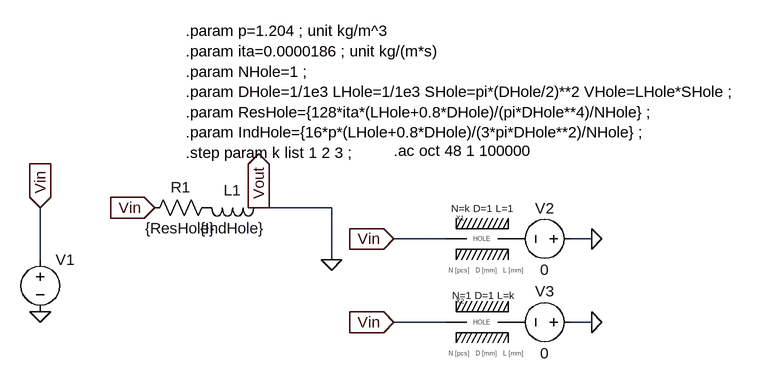
[diagram p0: schematic Hole_test.asc]
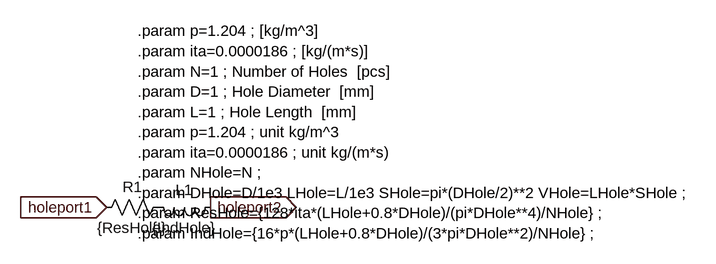
[diagram p1: sub-circuit holemodel.asc]
Hole_test.asc, the LTspice schematic file:
Version 4
SHEET 1 1264 680
WIRE 432 432 320 432
WIRE 608 480 528 480
WIRE 832 480 800 480
WIRE -16 512 -16 432
WIRE 432 512 432 432
WIRE 608 608 528 608
WIRE 832 608 800 608
FLAG 160 432 Vin
IOPIN 160 432 In
FLAG 320 432 Vout
IOPIN 320 432 Out
FLAG -16 592 0
FLAG 432 512 0
FLAG -16 432 Vin
IOPIN -16 432 In
FLAG 832 480 0
FLAG 832 608 0
FLAG 528 608 Vin
IOPIN 528 608 In
FLAG 528 480 Vin
IOPIN 528 480 In
SYMBOL res 256 416 R90
WINDOW 0 0 56 VBottom 2
WINDOW 3 32 56 VTop 2
SYMATTR InstName R1
SYMATTR Value {ResHole}
SYMBOL ind 336 416 R90
WINDOW 0 5 56 VBottom 2
WINDOW 3 32 56 VTop 2
SYMATTR InstName L1
SYMATTR Value {IndHole}
SYMBOL voltage -16 496 R0
SYMATTR InstName V1
SYMATTR Value ""
SYMATTR Value2 AC 1
SYMBOL voltage 816 480 R90
WINDOW 0 -32 56 VBottom 2
WINDOW 3 32 56 VTop 2
SYMATTR InstName V2
SYMATTR Value 0
SYMATTR SpiceLine Rser=0
SYMBOL voltage 816 608 R90
WINDOW 0 -32 56 VBottom 2
WINDOW 3 32 56 VTop 2
SYMATTR InstName V3
SYMATTR Value 0
SYMATTR SpiceLine Rser=0
SYMBOL My_symbol/Holemodel 624 448 R0
WINDOW 0 0 0 Left 0
WINDOW 39 -8 -15 Left 1
SYMATTR InstName X1
SYMATTR SpiceLine N=k D=1 L=1
SYMBOL My_symbol/Holemodel 624 576 R0
WINDOW 0 0 0 Left 0
WINDOW 39 -6 -9 Left 1
SYMATTR InstName X2
SYMATTR SpiceLine N=1 D=1 L=k
TEXT 208 160 Left 2 !.param p=1.204 ; unit kg/m^3\n.param ita=0.0000186 ; unit kg/(m*s)\n.param NHole=1 ;\n.param DHole=1/1e3 LHole=1/1e3 SHole=pi*(DHole/2)**2 VHole=LHole*SHole ;\n.param ResHole={128*ita*(LHole+0.8*DHole)/(pi*DHole**4)/NHole} ;\n.param IndHole={16*p*(LHole+0.8*DHole)/(3*pi*DHole**2)/NHole} ;\n.step param k list 1 2 3 ;
TEXT 528 344 Left 2 !.ac oct 48 1 100000

holemodel.asc, the sub-circuit schematic file:
Version 4
SHEET 1 1216 680
FLAG 160 432 holeport1
IOPIN 160 432 In
FLAG 320 432 holeport2
IOPIN 320 432 Out
SYMBOL res 256 416 R90
WINDOW 0 0 56 VBottom 2
WINDOW 3 32 56 VTop 2
SYMATTR InstName R1
SYMATTR Value {ResHole}
SYMBOL ind 336 416 R90
WINDOW 0 5 56 VBottom 2
WINDOW 3 32 56 VTop 2
SYMATTR InstName L1
SYMATTR Value {IndHole}
TEXT 208 160 Left 2 !.param p=1.204 ; [kg/m^3]\n.param ita=0.0000186 ; [kg/(m*s)]\n.param N=1 ; Number of Holes  [pcs]\n.param D=1 ; Hole Diameter  [mm]\n.param L=1 ; Hole Length  [mm]\n.param p=1.204 ; unit kg/m^3\n.param ita=0.0000186 ; unit kg/(m*s)\n.param NHole=N ;\n.param DHole=D/1e3 LHole=L/1e3 SHole=pi*(DHole/2)**2 VHole=LHole*SHole ;\n.param ResHole={128*ita*(LHole+0.8*DHole)/(pi*DHole**4)/NHole} ;\n.param IndHole={16*p*(LHole+0.8*DHole)/(3*pi*DHole**2)/NHole} ;

The netlist it stands for:
* Hole_test.asc
R1 P001 Vin {ResHole}
L1 0 P001 {IndHole}
V1 Vin 0 AC 1
V2 0 P002 0 Rser=0
V3 0 P003 0 Rser=0
XX1 Vin P002 holemodel params: N=k D=1 L=1
XX2 Vin P003 holemodel params: N=1 D=1 L=k

* block symbol definitions
.subckt holemodel holeport1 holeport2
R1 P001 holeport1 {ResHole}
L1 holeport2 P001 {IndHole}
.param p=1.204 ; [kg/m^3]
.param ita=0.0000186 ; [kg/(m*s)]
.param N=1 ; Number of Holes  [pcs]
.param D=1 ; Hole Diameter  [mm]
.param L=1 ; Hole Length  [mm]
.param p=1.204 ; unit kg/m^3
.param ita=0.0000186 ; unit kg/(m*s)
.param NHole=N ;
.param DHole=D/1e3 LHole=L/1e3 SHole=pi*(DHole/2)**2 VHole=LHole*SHole ;
.param ResHole={128*ita*(LHole+0.8*DHole)/(pi*DHole**4)/NHole} ;
.param IndHole={16*p*(LHole+0.8*DHole)/(3*pi*DHole**2)/NHole} ;
.ends holemodel

.param p=1.204 ; unit kg/m^3
.param ita=0.0000186 ; unit kg/(m*s)
.param NHole=1 ;
.param DHole=1/1e3 LHole=1/1e3 SHole=pi*(DHole/2)**2 VHole=LHole*SHole ;
.param ResHole={128*ita*(LHole+0.8*DHole)/(pi*DHole**4)/NHole} ;
.param IndHole={16*p*(LHole+0.8*DHole)/(3*pi*DHole**2)/NHole} ;
.step param k list 1 2 3 ;
.ac oct 48 1 100000
.backanno
.end